# Altium schematic sheet RJ45_Ethernet.SchDoc
size A; SheetNumber: 7; SheetTotal: 11
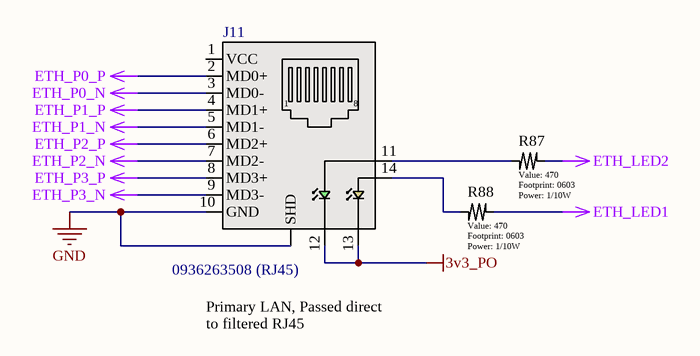
[diagram p0: RJ45_Ethernet.SchDoc]

## Parts
J11  0936263508 (RJ45)  [0936263508]
R87  value 470  Power: 1/10W  [0603]  (hidden comment: Generic Resistor)
R88  value 470  Power: 1/10W  [0603]  (hidden comment: Generic Resistor)

## Nets
3v3_PO: J11.12(Cathode) J11.13(Cathode)
ETH_LED1: R88.2
ETH_LED2: R87.2
ETH_P0_N: J11.3(MD0-)
ETH_P0_P: J11.2(MD0+)
ETH_P1_N: J11.5(MD1-)
ETH_P1_P: J11.4(MD1+)
ETH_P2_N: J11.7(MD2-)
ETH_P2_P: J11.6(MD2+)
ETH_P3_N: J11.9(MD3-)
ETH_P3_P: J11.8(MD3+)
GND: J11.10(GND) J11.SHD
NetJ11_11: J11.11(Anode) R87.1
NetJ11_14: J11.14(Anode) R88.1

Not connected (* = marked no-connect by the designer): J11 1(VCC)

## Notes on the sheet
- Primary LAN, Passed direct to filtered RJ45
- REV
- REVISIONS
- DATE
- DESCRIPTION
- BY
- UNLESS OTHERWISE SPECIFIED, DRAWING DEFINITIONS AND TOLERANCES SHALL BE FOUND UNDER SUPPLIER STANDARDS SS-001. THIS PART AND ALL COMPONENTS OF IT MUST BE RoHS & REACH COMPLIANT. A CERTIFICATE OF COMPLIANCE MUST BE PROVIDED UPON REQUEST.
- ALL INFORMATION ON THIS DOCUMENT IS THE SOLE PROPERTY OF GAMBER-JOHNSON AND SHALL NOT BE COPIED, REPRODUCED, USED OR DISCLOSED IN WHOLE OR IN PART WITHOUT THE WRITTEN CONSENT OF GAMBER-JOHNSON
- TOLERANCES
  .00 ± .060
  .000 ± .020
  .0000 ± .005
  ANGELS ± 1°
- DRAWN BY:
- PROJECT NUMBER:
- SHEET TITLE:
- SHEET
- OF
- DATE:
- LOCATION:
- ASSEMBLY NUMBER
- SIZE
- GAMBER-JOHNSON LLC
  5001 Joerns Dr
  STEVENS POINT, WI 54481
  +1 (715) 344-5209
- A

## Library data of the parts
J11 = 0936263508  (RJ45): 1 Port RJ45Through Hole 10/100/1000 Base-T, AutoMDIX; Manufacturer 1: Molex; Direction: Down; Number of Ports: 1; Number of Cores per Jack: 8; Shielding: Shielded; Supplier 1: Digi-Key; Manufacturer Part Number 1: 0936263508; RoHS: Yes; Category: Modular / Ethernet Connectors; Stock 1: 835; Pricing 1: 1=4.82000, 10=4.23800, 112=3.37134, 2408=2.60074 (USD); Mount: Through Hole; Color: Green,Yellow; Contact Material: Bronze; Contact Plating: Gold; Housing Material: Polymer; Min Operating Temperature: 0°C; Max Operating Temperature: 70°C; Connector Type: RJ45; Packaging: Tray; Number of Rows: 1; Termination: Solder; RoHS Compliant: Yes; ComponentLink1URL: https://www.molex.com/pdm_docs/sd/936263508_sd.pdf?src-supplier=Digi-Key; ComponentLink1Description: https://www.molex.com/pdm_docs/sd/936263508_sd.pdf?src-supplier=Digi-Key; Supplier Part Number 1: WM17616-ND; LCSC PN: C54408
R87 R88 = Generic Resistor: Tolerance: 1%